# Altium schematic sheet Connectors.SchDoc
size A4
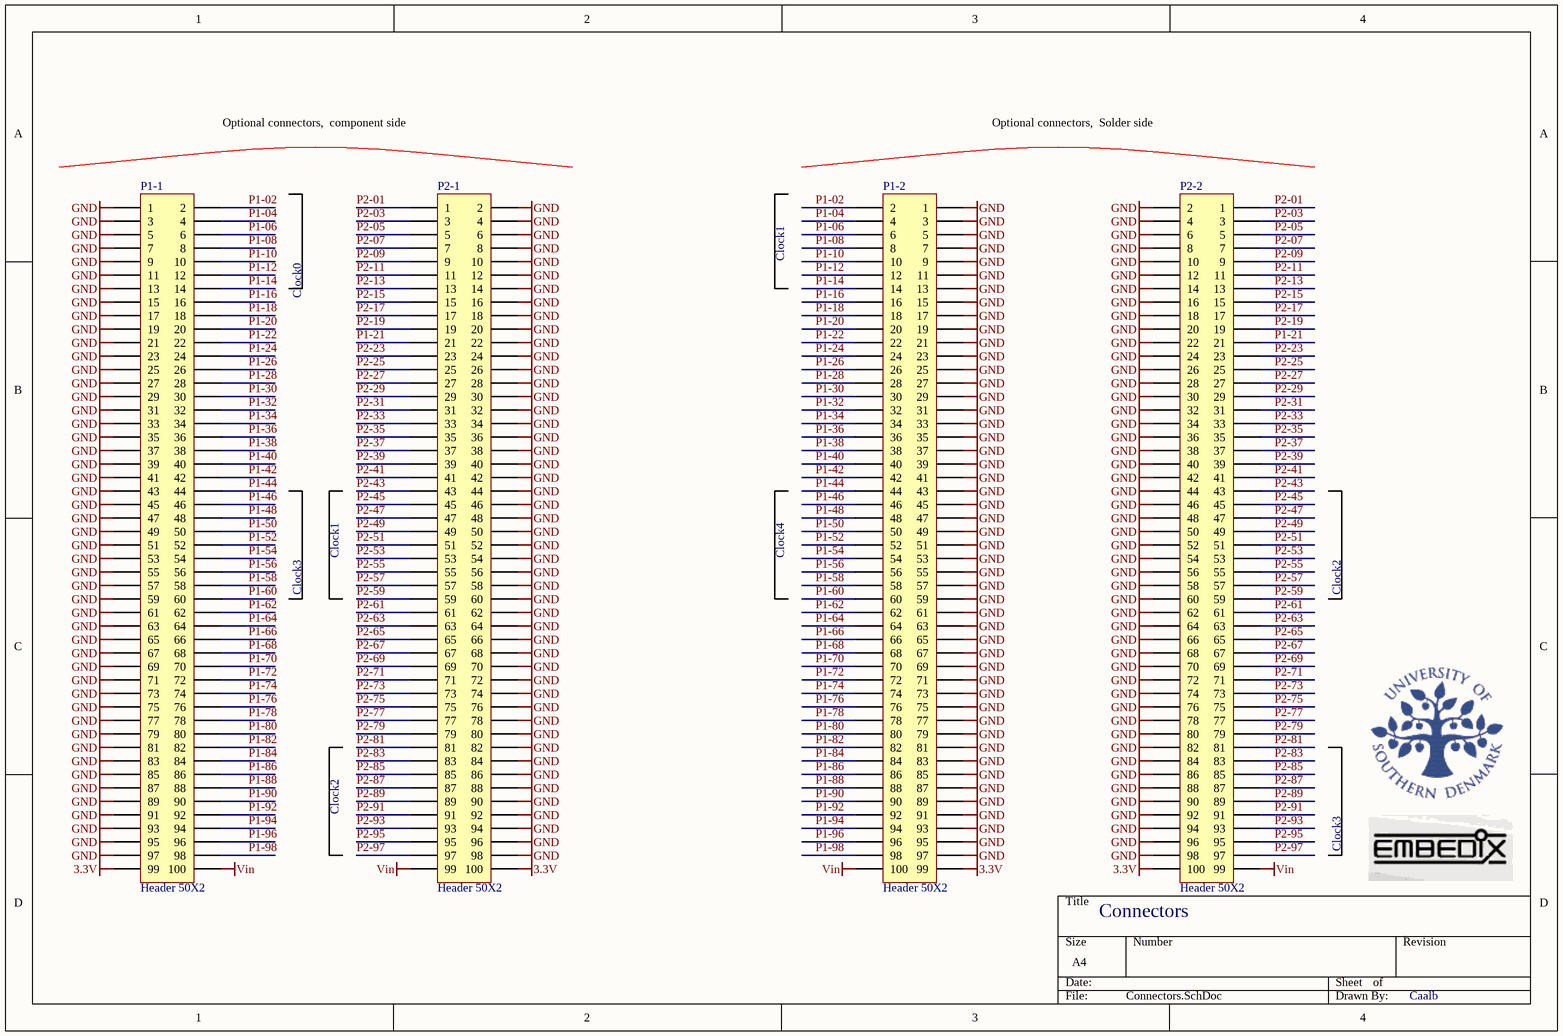
[diagram p0: Connectors.SchDoc]

## Parts
P1-1  Header 50X2  [FX8C-100S-SV(91)]
P1-2  Header 50X2  [FX8C-100P-SV6(91)]
P2-1  Header 50X2  [FX8C-100S-SV(91)]
P2-2  Header 50X2  [FX8C-100P-SV6(91)]

## Nets
3.3V: P1-1.99 P1-2.99 P2-1.100 P2-2.100
GND: P1-1.1 P1-1.3 P1-1.5 P1-1.7 P1-1.9 P1-1.11 P1-1.13 P1-1.15 P1-1.17 P1-1.19 P1-1.21 P1-1.23 P1-1.25 P1-1.27 P1-1.29 P1-1.31 P1-1.33 P1-1.35 P1-1.37 P1-1.39 P1-1.41 P1-1.43 P1-1.45 P1-1.47 P1-1.49 P1-1.51 P1-1.53 P1-1.55 P1-1.57 P1-1.59 P1-1.61 P1-1.63 P1-1.65 P1-1.67 P1-1.69 P1-1.71 P1-1.73 P1-1.75 P1-1.77 P1-1.79 P1-1.81 P1-1.83 P1-1.85 P1-1.87 P1-1.89 P1-1.91 P1-1.93 P1-1.95 P1-1.97 P1-2.1 P1-2.3 P1-2.5 P1-2.7 P1-2.9 P1-2.11 P1-2.13 P1-2.15 P1-2.17 P1-2.19 P1-2.21 P1-2.23 P1-2.25 P1-2.27 P1-2.29 P1-2.31 P1-2.33 P1-2.35 P1-2.37 P1-2.39 P1-2.41 P1-2.43 P1-2.45 P1-2.47 P1-2.49 P1-2.51 P1-2.53 P1-2.55 P1-2.57 P1-2.59 P1-2.61 P1-2.63 P1-2.65 P1-2.67 P1-2.69 P1-2.71 P1-2.73 P1-2.75 P1-2.77 P1-2.79 P1-2.81 P1-2.83 P1-2.85 P1-2.87 P1-2.89 P1-2.91 P1-2.93 P1-2.95 P1-2.97 P2-1.2 P2-1.4 P2-1.6 P2-1.8 P2-1.10 P2-1.12 P2-1.14 P2-1.16 P2-1.18 P2-1.20 P2-1.22 P2-1.24 P2-1.26 P2-1.28 P2-1.30 P2-1.32 P2-1.34 P2-1.36 P2-1.38 P2-1.40 P2-1.42 P2-1.44 P2-1.46 P2-1.48 P2-1.50 P2-1.52 P2-1.54 P2-1.56 P2-1.58 P2-1.60 P2-1.62 P2-1.64 P2-1.66 P2-1.68 P2-1.70 P2-1.72 P2-1.74 P2-1.76 P2-1.78 P2-1.80 P2-1.82 P2-1.84 P2-1.86 P2-1.88 P2-1.90 P2-1.92 P2-1.94 P2-1.96 P2-1.98 P2-2.2 P2-2.4 P2-2.6 P2-2.8 P2-2.10 P2-2.12 P2-2.14 P2-2.16 P2-2.18 P2-2.20 P2-2.22 P2-2.24 P2-2.26 P2-2.28 P2-2.30 P2-2.32 P2-2.34 P2-2.36 P2-2.38 P2-2.40 P2-2.42 P2-2.44 P2-2.46 P2-2.48 P2-2.50 P2-2.52 P2-2.54 P2-2.56 P2-2.58 P2-2.60 P2-2.62 P2-2.64 P2-2.66 P2-2.68 P2-2.70 P2-2.72 P2-2.74 P2-2.76 P2-2.78 P2-2.80 P2-2.82 P2-2.84 P2-2.86 P2-2.88 P2-2.90 P2-2.92 P2-2.94 P2-2.96 P2-2.98
Vin: P1-1.100 P1-2.100 P2-1.99 P2-2.99
P1-02: P1-1.2 P1-2.2
P1-04: P1-1.4 P1-2.4
P1-06: P1-1.6 P1-2.6
P1-08: P1-1.8 P1-2.8
P1-10: P1-1.10 P1-2.10
P1-12: P1-1.12 P1-2.12
P1-14: P1-1.14 P1-2.14
P1-16: P1-1.16 P1-2.16
P1-18: P1-1.18 P1-2.18
P1-20: P1-1.20 P1-2.20
P1-21: P2-1.21 P2-2.21
P1-22: P1-1.22 P1-2.22
P1-24: P1-1.24 P1-2.24
P1-26: P1-1.26 P1-2.26
P1-28: P1-1.28 P1-2.28
P1-30: P1-1.30 P1-2.30
P1-32: P1-1.32 P1-2.32
P1-34: P1-1.34 P1-2.34
P1-36: P1-1.36 P1-2.36
P1-38: P1-1.38 P1-2.38
P1-40: P1-1.40 P1-2.40
P1-42: P1-1.42 P1-2.42
P1-44: P1-1.44 P1-2.44
P1-46: P1-1.46 P1-2.46
P1-48: P1-1.48 P1-2.48
P1-50: P1-1.50 P1-2.50
P1-52: P1-1.52 P1-2.52
P1-54: P1-1.54 P1-2.54
P1-56: P1-1.56 P1-2.56
P1-58: P1-1.58 P1-2.58
P1-60: P1-1.60 P1-2.60
P1-62: P1-1.62 P1-2.62
P1-64: P1-1.64 P1-2.64
P1-66: P1-1.66 P1-2.66
P1-68: P1-1.68 P1-2.68
P1-70: P1-1.70 P1-2.70
P1-72: P1-1.72 P1-2.72
P1-74: P1-1.74 P1-2.74
P1-76: P1-1.76 P1-2.76
P1-78: P1-1.78 P1-2.78
P1-80: P1-1.80 P1-2.80
P1-82: P1-1.82 P1-2.82
P1-84: P1-1.84 P1-2.84
P1-86: P1-1.86 P1-2.86
P1-88: P1-1.88 P1-2.88
P1-90: P1-1.90 P1-2.90
P1-92: P1-1.92 P1-2.92
P1-94: P1-1.94 P1-2.94
P1-96: P1-1.96 P1-2.96
P1-98: P1-1.98 P1-2.98
P2-01: P2-1.1 P2-2.1
P2-03: P2-1.3 P2-2.3
P2-05: P2-1.5 P2-2.5
P2-07: P2-1.7 P2-2.7
P2-09: P2-1.9 P2-2.9
P2-11: P2-1.11 P2-2.11
P2-13: P2-1.13 P2-2.13
P2-15: P2-1.15 P2-2.15
P2-17: P2-1.17 P2-2.17
P2-19: P2-1.19 P2-2.19
P2-23: P2-1.23 P2-2.23
P2-25: P2-1.25 P2-2.25
P2-27: P2-1.27 P2-2.27
P2-29: P2-1.29 P2-2.29
P2-31: P2-1.31 P2-2.31
P2-33: P2-1.33 P2-2.33
P2-35: P2-1.35 P2-2.35
P2-37: P2-1.37 P2-2.37
P2-39: P2-1.39 P2-2.39
P2-41: P2-1.41 P2-2.41
P2-43: P2-1.43 P2-2.43
P2-45: P2-1.45 P2-2.45
P2-47: P2-1.47 P2-2.47
P2-49: P2-1.49 P2-2.49
P2-51: P2-1.51 P2-2.51
P2-53: P2-1.53 P2-2.53
P2-55: P2-1.55 P2-2.55
P2-57: P2-1.57 P2-2.57
P2-59: P2-1.59 P2-2.59
P2-61: P2-1.61 P2-2.61
P2-63: P2-1.63 P2-2.63
P2-65: P2-1.65 P2-2.65
P2-67: P2-1.67 P2-2.67
P2-69: P2-1.69 P2-2.69
P2-71: P2-1.71 P2-2.71
P2-73: P2-1.73 P2-2.73
P2-75: P2-1.75 P2-2.75
P2-77: P2-1.77 P2-2.77
P2-79: P2-1.79 P2-2.79
P2-81: P2-1.81 P2-2.81
P2-83: P2-1.83 P2-2.83
P2-85: P2-1.85 P2-2.85
P2-87: P2-1.87 P2-2.87
P2-89: P2-1.89 P2-2.89
P2-91: P2-1.91 P2-2.91
P2-93: P2-1.93 P2-2.93
P2-95: P2-1.95 P2-2.95
P2-97: P2-1.97 P2-2.97

## Notes on the sheet
- Optional connectors,  component side
- Optional connectors,  Solder side
- Clock0
- Clock1
- Clock3
- Clock4
- Clock2
- (near P2-2) Connectors
- Caalb

## Library data of the parts
P1-1 P2-1 = Header 50X2: FX8C-100S-SV(91); LatestRevisionDate: 17-Jul-2002; LatestRevisionNote: Re-released for DXP Platform.; Publisher: Altium Limited
P1-2 P2-2 = Header 50X2: FX8C-100P-SV6(91); LatestRevisionDate: 17-Jul-2002; LatestRevisionNote: Re-released for DXP Platform.; Publisher: Altium Limited